# EAGLE design rf_node (EAGLE 9.6.2)

## Sheet 1 of 2
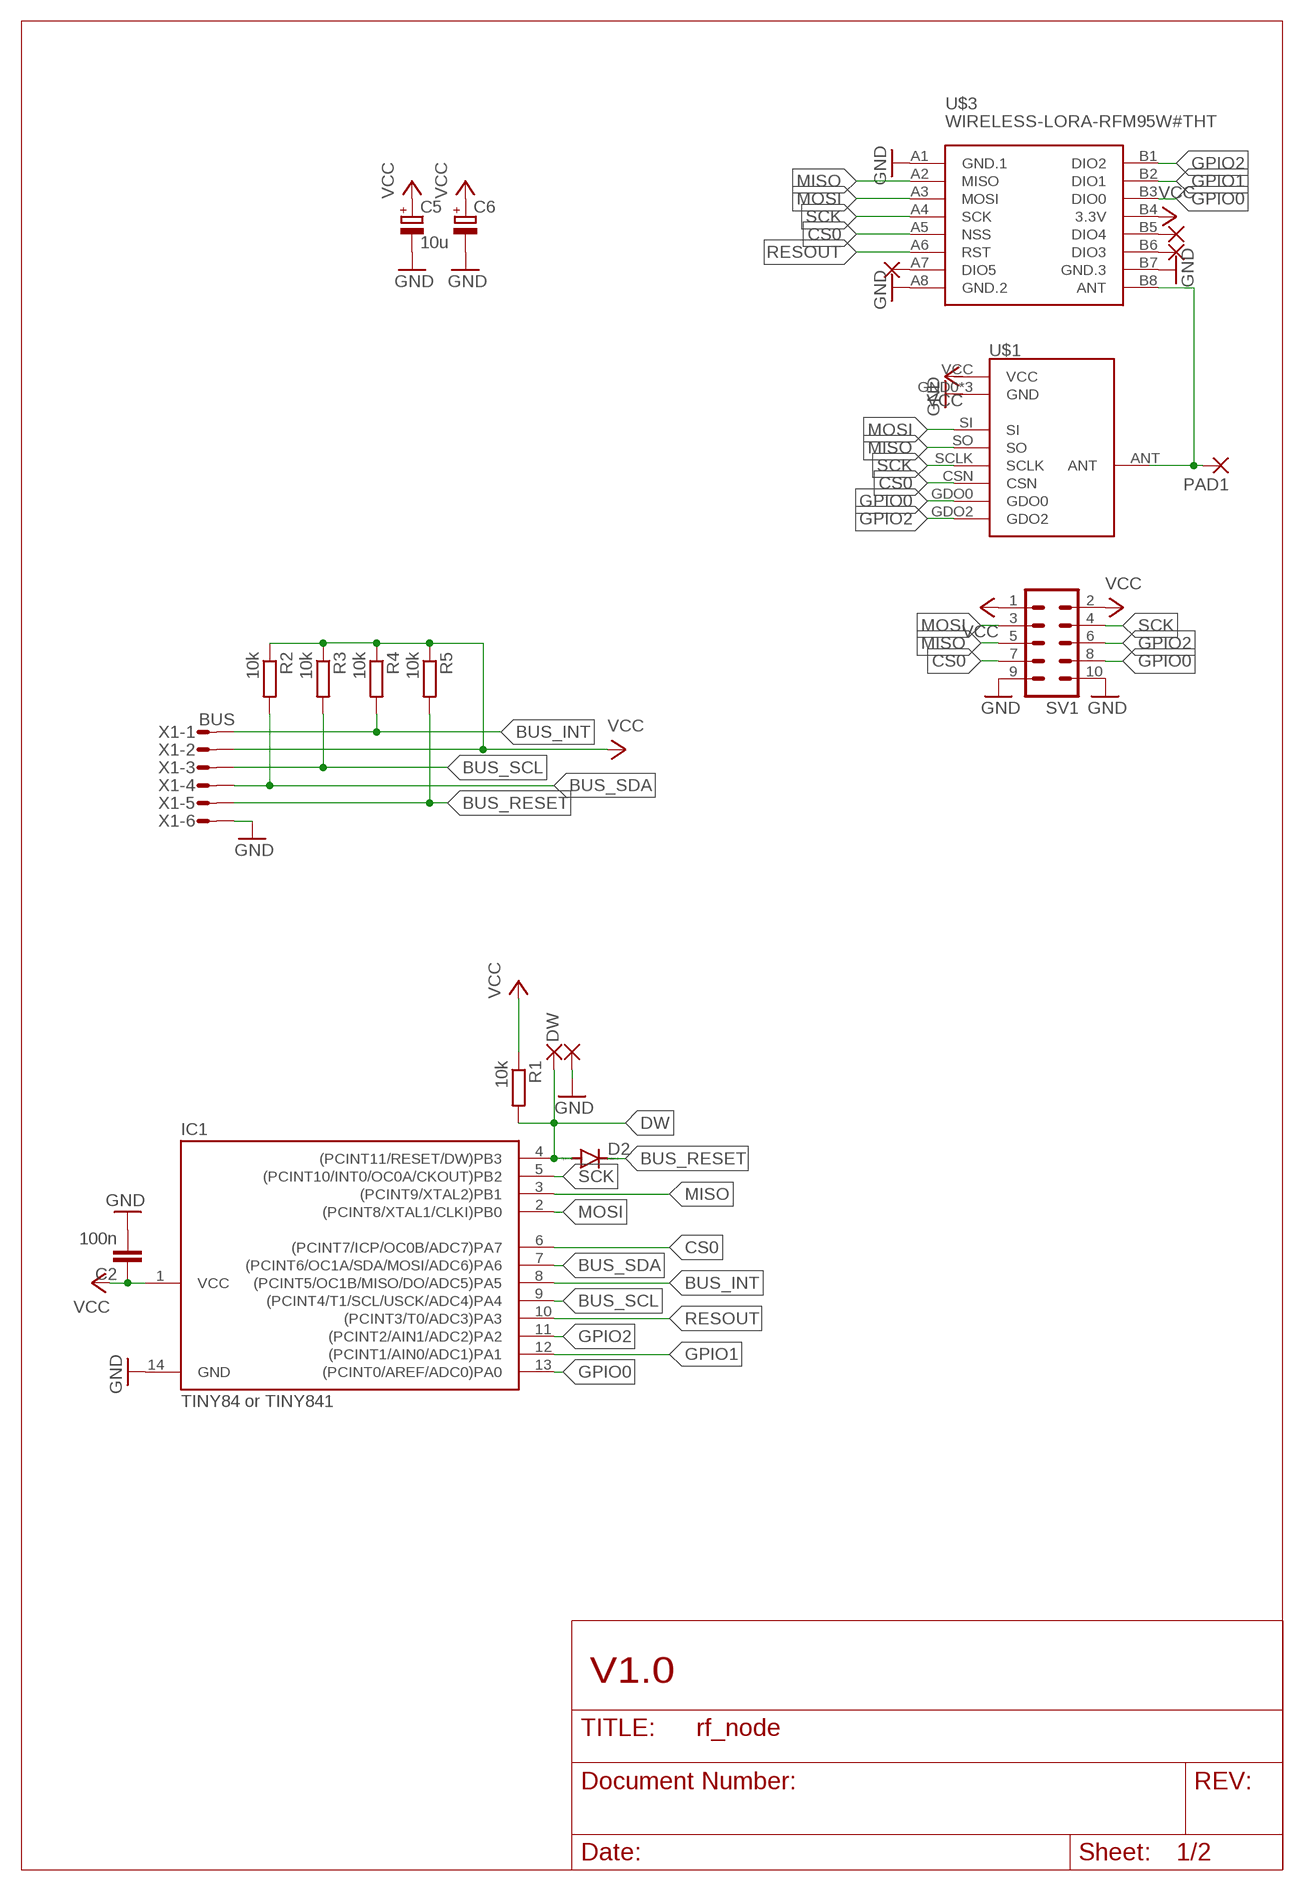
[diagram p0: schematic, sheet 1]

### Parts
C2  100n  C-EUC0805  [C0805]
C5  10u  CPOL-EUB/3528-21W  [B/3528-21W]
C6  CPOL-EUC/6032-28R  [C/6032-28R]
D2  DIODE-MINIMELF  [MINIMELF]
DW  1,6/0,9  [1,6/0,9]
GND_  1,6/0,9  [1,6/0,9]
IC1  TINY84 or TINY841  TINY24/44/84-SSU  [SOIC14]
PAD1  1,6/0,8  [1,6/0,8]
PAD2  1,6/0,8  [1,6/0,8]
PAD3  1,6/0,8  [1,6/0,8]
PAD4  1,6/0,8  [1,6/0,8]
R1  10k  R-EU_M0805  [M0805]
R2  10k  R-EU_M0805  [M0805]
R3  10k  R-EU_M0805  [M0805]
R4  10k  R-EU_M0805  [M0805]
R5  10k  R-EU_M0805  [M0805]
SV1  MA05-2  [MA05-2]
U$1  CC1101  [CC1101]
U$3  WIRELESS-LORA-RFM95W#THT  [WIRELESS-LORA-RFM95W#THT]
X1  BUS  MICROMATCH-6  [MICROMATCH-6]

### Nets
BUS_INT: IC1.8((PCINT5/OC1B/MISO/DO/ADC5)PA5) R4.2 X1.1
BUS_RESET: D2.C R5.2 X1.5
BUS_SCL: IC1.9((PCINT4/T1/SCL/USCK/ADC4)PA4) R3.2 X1.3
BUS_SDA: IC1.7((PCINT6/OC1A/SDA/MOSI/ADC6)PA6) R2.2 X1.4
CS0: IC1.6((PCINT7/ICP/OC0B/ADC7)PA7) SV1.7 U$1.CSN U$3.A5(NSS)
DW: D2.A DW.1(P) IC1.4((PCINT11/RESET/DW)PB3) R1.2
GND [gnd]: C2.2 C5.- C6.- GND_.1(P) IC1.14(GND) SV1.9 SV1.10 U$3.A1(GND.1) U$3.A8(GND.2) U$3.B7(GND.3) X1.6
GPIO0: IC1.13((PCINT0/AREF/ADC0)PA0) SV1.8 U$1.GDO0 U$3.B3(DIO0)
GPIO1: IC1.12((PCINT1/AIN0/ADC1)PA1) U$3.B2(DIO1)
GPIO2: IC1.11((PCINT2/AIN1/ADC2)PA2) SV1.6 U$1.GDO2 U$3.B1(DIO2)
MISO: IC1.3((PCINT9/XTAL2)PB1) SV1.5 U$1.SO U$3.A2(MISO)
MOSI: IC1.2((PCINT8/XTAL1/CLKI)PB0) SV1.3 U$1.SI U$3.A3(MOSI)
N$1: PAD1.1(P) U$1.ANT U$3.B8(ANT)
N$2: PAD2.1(P) U$3.B6(DIO3)
N$3: PAD3.1(P) U$3.B5(DIO4)
N$4: PAD4.1(P) U$3.A7(DIO5)
RESOUT: IC1.10((PCINT3/T0/ADC3)PA3) U$3.A6(RST)
SCK: IC1.5((PCINT10/INT0/OC0A/CKOUT)PB2) SV1.4 U$1.SCLK U$3.A4(SCK)
VCC [power]: C2.1 C5.+ C6.+ IC1.1(VCC) R1.1 R2.1 R3.1 R4.1 R5.1 SV1.1 SV1.2 U$3.B4(3.3V) X1.2

### Notes on the sheet
- V1.0

## Sheet 2 of 2

## Power pins joined to a net without a drawn wire
GND: U$1.GND0(GND) U$1.GND1(GND) U$1.GND2(GND)
VCC: U$1.VCC

## Library data of the parts
C2 = rcl:C-EU: CAPACITOR, European symbol
C5 C6 = rcl:CPOL-EU: POLARIZED CAPACITOR, European symbol; SPICEPREFIX: C
D2 = diode:DIODE-: DIODE
DW GND_ = wirepad:1,6/0,9: THROUGH-HOLE PAD
IC1 = avr-7:TINY24/44/84
PAD1-PAD4 = wirepad:1,6/0,8: THROUGH-HOLE PAD
R1-R5 = rcl:R-EU_: RESISTOR, European symbol; SPICEPREFIX: R
SV1 = con-lstb:MA05-2: PIN HEADER; OC_FARNELL: unknown; OC_NEWARK: unknown
U$1 = modules:CC1101
U$3 = diy-modules:WIRELESS-LORA-RFM95W: 868/915 MHz LoRa Radio Transceiver Module based on SX1276 chip Click here to find device on ebay.com <http://www.ebay.com/sch/RFM95W+transceiver>
X1 = con-amp-micromatch:MICROMATCH-6: MicroMaTch 6 7-215464-6 / 0-215464-6 Drawing Number C-215464 DDEController.pdf; MPN: 7-215464-6; OC_FARNELL: 3784630; OC_NEWARK: 19R8125

## Net classes
1 gnd: width 0.762 mm, drill 0.762 mm
2 power: width 0.762 mm, drill 0.762 mm

## Board
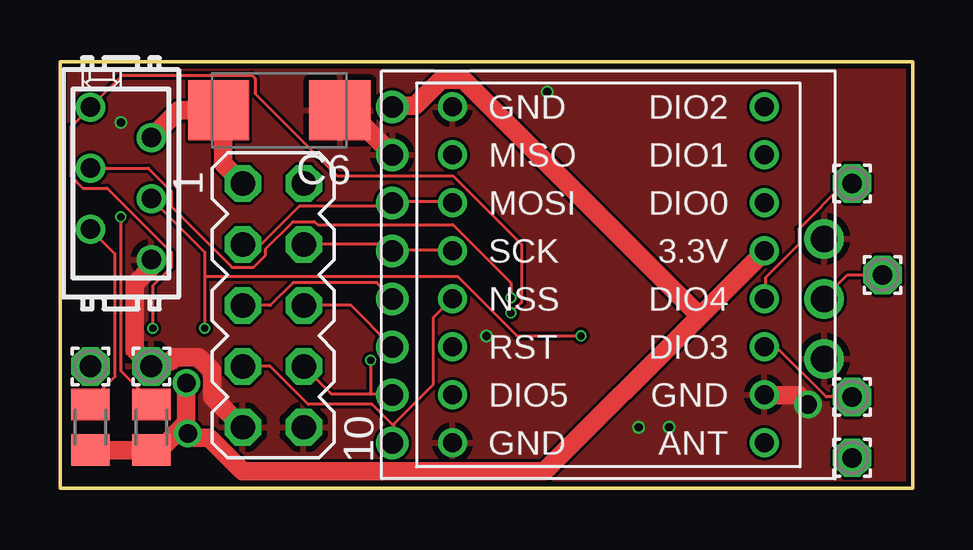
[diagram p1: board, top side]
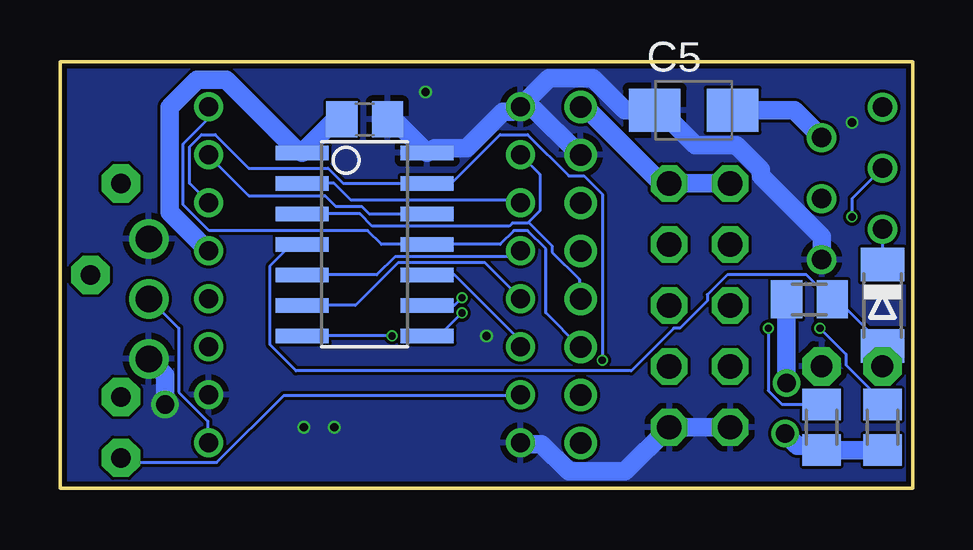
[diagram p2: board, bottom side, seen from below]

Size 35.56 x 17.78 mm. Coordinates in mm from the lower left corner, seen from the top.
Outline: 0,0 35.56,0 35.56,17.78 0,17.78 0,0
Copper layers (1*16): Top 0.035559375mm / dielectric 1.6mm / Bottom 0.035559375mm
Design rules "jlcpcb2layer": minimum track width 5mil, minimum drill 12mil, track to track 5mil, track to pad 5mil, pad to pad 5mil, via to via 5mil, smd to smd 5mil, copper to edge 8mil, drill to drill 6mil, minimum pad ring 5mil, minimum via ring 3mil, stop-mask expansion 2.5mil, vias tented up to drill 0mil, thermal gap 10mil

### Footprints (pad centres in the part's own frame; a part is rotated, then mirrored left to right if it is on the bottom)
C0805 = smd 1.3 x 1.5: 1 -0.95,0; 2 0.95,0
B/3528-21W = smd 2.15 x 1.8: + 1.625,0; - -1.625,0
C/6032-28R = smd 2.55 x 2.5: + 2.525,0; - -2.525,0
MINIMELF = smd 1.4 x 1.8: A 1.7,0; C -1.7,0
1,6/0,9 = drill 0.914 pad 1.6 octagon: 1 0,0
SOIC14 = smd 0.61 x 2.21: 1 -3.81,-2.603; 2 -2.54,-2.603; 3 -1.27,-2.603; 4 0,-2.603; 5 1.27,-2.603; 6 2.54,-2.603; 7 3.81,-2.603; 8 3.81,2.603; 9 2.54,2.603; 10 1.27,2.603; 11 0,2.603; 12 -1.27,2.603; 13 -2.54,2.603; 14 -3.81,2.603
1,6/0,8 = drill 0.813 pad 1.6 octagon: 1 0,0
M0805 = smd 1.3 x 1.6: 1 -0.95,0; 2 0.95,0
MA05-2 = drill 1.016 octagon: 1 -5.08,-1.27; 2 -5.08,1.27; 3 -2.54,-1.27; 4 -2.54,1.27; 5 0,-1.27; 6 0,1.27; 7 2.54,-1.27; 8 2.54,1.27; 9 5.08,-1.27; 10 5.08,1.27
CC1101 = drill 1.1: ANT 9,-1; GND1 9,-3.5; GND2 9,1.5 | drill 0.9: CSN -9,-7; GDO0 -9,-5; GDO2 -9,-3; GND0 -9,5; SCLK -9,1; SI -9,3; SO -9,-1; VCC -9,7
WIRELESS-LORA-RFM95W#THT = drill 0.8: A1 -6.5,7; A2 -6.5,5; A3 -6.5,3; A4 -6.5,1; A5 -6.5,-1; A6 -6.5,-3; A7 -6.5,-5; A8 -6.5,-7; B1 6.5,7; B2 6.5,5; B3 6.5,3; B4 6.5,1; B5 6.5,-1; B6 6.5,-3; B7 6.5,-5; B8 6.5,-7
MICROMATCH-6 = drill 0.813: 1 3.175,1.27; 2 1.905,-1.27; 3 0.635,1.27; 4 -0.635,-1.27; 5 -1.905,1.27; 6 -3.175,-1.27

### Placement (x,y rotation side)
C2  22.86,15.37 0 bottom
C5  9.14,15.75 0 bottom
C6  9.14,15.75 180 top
D2  1.27,7.62 270 bottom
DW  1.27,5.08 0 top
GND_  3.81,5.08 0 top
IC1  22.86,10.16 270 bottom
PAD1  34.29,8.89 0 top
PAD2  33.02,3.81 0 top
PAD3  33.02,12.7 0 top
PAD4  33.02,1.27 0 top
R1  4.32,7.87 0 bottom
R2  3.81,2.54 90 bottom
R3  3.81,2.54 90 top
R4  1.27,2.54 90 bottom
R5  1.27,2.54 90 top
SV1  8.89,7.62 270 top
U$1  22.86,8.89 0 top
U$3  22.86,8.89 0 top
X1  2.54,12.7 90 top

### Tracks (layer width: path | path; a pad name or v marks a point on that pad's centre or on a via)
BUS_INT  (via drill 0.3)
  Top 0.127: v3.87,6.67 3.87,8.45 4.64,9.21 4.64,9.84 1.97,12.51 0.95,12.51 0.45,13.02 0.45,15.05 X1.1 2.6,17.21 8,17.21 8.13,17.08 8.13,16.45 11.56,13.02 16.38,13.02 19.24,10.16 19.24,7.75 v18.8,7.3
  Bottom 0.127: R4.2 1.27,3.62 2.79,5.14 2.79,5.59 v3.87,6.67 | IC1.8 19.75,6.35 v18.8,7.3
BUS_RESET
  Top 0.127: R5.2 1.27,3.62 2.29,4.64 2.29,9.78 X1.5
  Bottom 0.127: X1.5 D2.C
BUS_SCL  (via drill 0.3)
  Top 0.127: R3.2 3.81,3.62 2.54,4.89 v2.54,11.3 | v18.8,7.94 18.8,8.57 16.38,10.99 10.73,10.99 10.6,11.11 9.72,11.11 8.57,9.97 8.57,9.72 8.06,9.21 7.18,9.21 4.64,11.75 4.64,12.38 3.68,13.34 X1.3
  Bottom 0.127: v2.54,11.3 2.54,12.06 X1.3 | IC1.9 19.11,7.62 v18.8,7.94
BUS_SDA  (via drill 0.3)
  Top 0.127: 6.03,8.83 6.03,9.84 X1.4 | 6.03,8.83 v6.03,6.67 | v21.72,6.35 19.05,6.35 16.57,8.83 6.03,8.83
  Bottom 0.127: v6.03,6.67 6.03,4.06 5.46,3.49 R2.2 | v21.72,6.35 IC1.7
CS0
  Top 0.127: 13.91,2.6 13.91,2.67 15.56,4.32 15.56,7.11 16.32,7.87 U$3.A5 | 13.91,2.6 13.91,1.91 U$1.CSN | SV1.7 8.76,5.08 10.35,3.49 13.02,3.49 13.91,2.6
  Bottom 0.127: IC1.6 23.24,7.62 21.46,9.4 17.84,9.4 16.38,7.94 U$3.A5
DW
  Bottom 0.127: IC1.4 25.91,10.16 26.8,9.27 26.8,5.97 25.72,4.89 11.75,4.89 9.97,6.67 9.72,6.67 8.57,7.81 8.57,8.06 7.75,8.89 4.45,8.89 3.43,7.87 R1.2 3.17,7.87 1.27,5.97 D2.A DW.1
GND  (via drill 0.35, 0.76)
  Top 0.762: X1.6 3.81,9.21 3.11,8.51 3.11,5.78 GND_.1 4.13,5.27 4.57,5.27 4.76,5.46 5.78,5.46 6.35,4.89 6.35,3.81 SV1.9 | v31.18,3.49 30.8,3.87 29.4,3.87 U$3.B7 | C6.- 12,15.75 13.84,13.91 U$1.GND0
  Bottom 0.762: U$3.A8 16.32,1.84 15.49,1.84 14.35,0.7 12,0.7 SV1.10 SV1.9 | C2.2 21.65,15.37 IC1.14 19.94,14.16 18.61,14.16 17.08,15.68 16.7,15.68 U$3.A1 | U$3.A1 16.32,15.94 15.18,17.08 13.34,17.08 12,15.75 C5.- 10.41,15.62 9.08,14.29 7.37,14.29 6.35,13.27 6.35,13.02 3.81,10.48 X1.6 | v31.18,3.49 31.18,4.7 31.81,5.33 U$1.GND1 | U$3.A1 15.88,15.88 13.91,13.91 U$1.GND0
  other vias: 24.13,2.54 25.4,2.54 17.78,6.35 2.54,15.24 20.32,16.51
  pour Top: 0,0 35.56,0 35.56,17.78 0,17.78
  pour Bottom: 0,0 35.56,0 35.56,17.78 0,17.78
GPIO0  (via drill 0.3)
  Top 0.127: 12.95,3.94 11.3,3.94 SV1.8 | 12.95,3.94 13.84,3.94 U$1.GDO0 | v12.95,5.33 12.95,3.94
  Bottom 0.127: U$3.B3 29.4,11.94 30.16,12.7 30.16,14.22 29.65,14.73 29.08,14.73 27.69,13.34 24.38,13.34 23.75,12.7 IC1.13 19.24,12.7 17.21,14.73 16.07,14.73 14.35,13.02 13.72,13.02 12.95,12.26 v12.95,5.33
GPIO1
  Bottom 0.127: IC1.12 22.67,11.43 22.99,11.75 24.07,11.75 24.51,12.19 27.69,12.19 29.34,13.84 U$3.B2
GPIO2
  Top 0.127: SV1.6 12.13,7.62 13.84,5.91 U$1.GDO2
  Bottom 0.127: U$1.GDO2 13.91,5.91 15.3,7.3 15.3,9.97 16.07,10.73 16.64,10.73 17.21,10.16 IC1.11 22.16,10.16 22.73,10.73 29.34,10.73 30.42,11.81 30.42,14.35 29.4,15.37 29.4,15.88 U$3.B1
MISO
  Top 0.127: SV1.5 8.76,7.62 9.72,8.57 13.21,8.57 13.84,7.94 U$1.SO
  Bottom 0.127: IC1.3 23.05,11.43 22.54,10.92 16.83,10.92 16.7,11.05 16.07,11.05 16.03,11.08 | 16.03,11.08 15.56,11.56 15.56,13.08 16.32,13.84 U$3.A2 | 16.03,11.08 15.05,10.1 15.05,9.84 13.91,8.7 13.91,7.94 U$1.SO
MOSI
  Top 0.127: U$3.A3 16.32,11.94 13.91,11.94 U$1.SI 13.84,11.87 13.72,11.75 9.97,11.75 8.38,10.16 SV1.3
  Bottom 0.127: IC1.2 24.13,12.7 23.43,12 16.45,12 16.38,11.94 U$3.A3
N$1
  Top 0.127: PAD1.1 32.83,8.89 31.88,7.94 U$1.ANT
  Bottom 0.127: U$3.B8 29.4,1.91 29.4,2.79 30.61,4 30.61,6.67 31.81,7.87 U$1.ANT
N$2
  Top 0.127: PAD2.1 31.94,3.81 29.91,5.84 29.4,5.84 U$3.B6
N$3
  Top 0.127: PAD3.1 32.7,12.7 30.8,10.79 30.8,10.16 29.4,8.76 29.4,7.94 U$3.B5
N$4
  Bottom 0.127: PAD4.1 32.83,1.08 29.02,1.08 26.23,3.87 16.38,3.87 U$3.A7
RESOUT
  Bottom 0.127: IC1.10 19.11,8.89 16.38,6.16 16.38,5.91 U$3.A6
SCK
  Top 0.127: U$3.A4 16.32,9.91 13.91,9.91 U$1.SCLK 13.84,9.91 13.59,10.16 SV1.4
  Bottom 0.127: IC1.5 22.35,8.89 21.59,9.65 16.57,9.65 16.38,9.84 U$3.A4
VCC  (via drill 0.76)
  Top 0.762: X1.2 4.95,15.75 C6.+ 6.79,15.43 6.79,13.53 SV1.1 | R5.1 R3.1 4.13,1.78 4.32,1.78 5.08,2.54 | v5.27,4.38 5.27,2.73 5.08,2.54 | 5.08,2.54 v5.33,2.29 5.65,2.1 6.22,2.1 7.62,0.7 20.19,0.7 26.67,7.18 | 26.67,7.18 29.34,9.84 U$3.B4 | 26.67,7.18 16.83,17.02 15.88,17.02 14.8,15.94 13.91,15.94 U$1.VCC
  Bottom 0.762: C5.+ 4.95,15.75 X1.2 | U$1.VCC 13.84,15.88 13.65,15.88 10.48,12.7 SV1.2 SV1.1 | R5.1 R3.1 4.13,1.78 4.83,1.78 v5.33,2.29 | v5.27,4.38 R1.1 | C2.1 24.07,15.37 IC1.1 25.78,14.16 28.64,17.02 29.84,17.02 30.99,15.88 30.99,11.49 29.4,9.91 U$3.B4